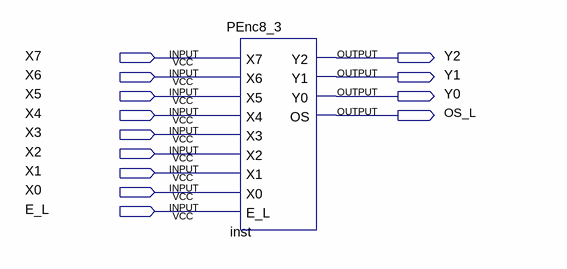
[diagram p0: schematic sheet]
// Quartus schematic EncoderDemo.bdf as structural Verilog: 1 symbols, 13 pins
module EncoderDemo (
  input  X7,
  input  X6,
  input  X5,
  input  X4,
  input  X3,
  input  X2,
  input  X1,
  input  X0,
  input  E_L,
  output Y2,
  output Y1,
  output Y0,
  output OS_L
);

  PEnc8_3 inst (
    .X7(X7), .X6(X6), .X5(X5), .X4(X4), .X3(X3), .X2(X2), .X1(X1), .X0(X0), .E_L(E_L), .Y2(Y2), .Y1(Y1),
    .Y0(Y0), .OS(OS_L));
endmodule
